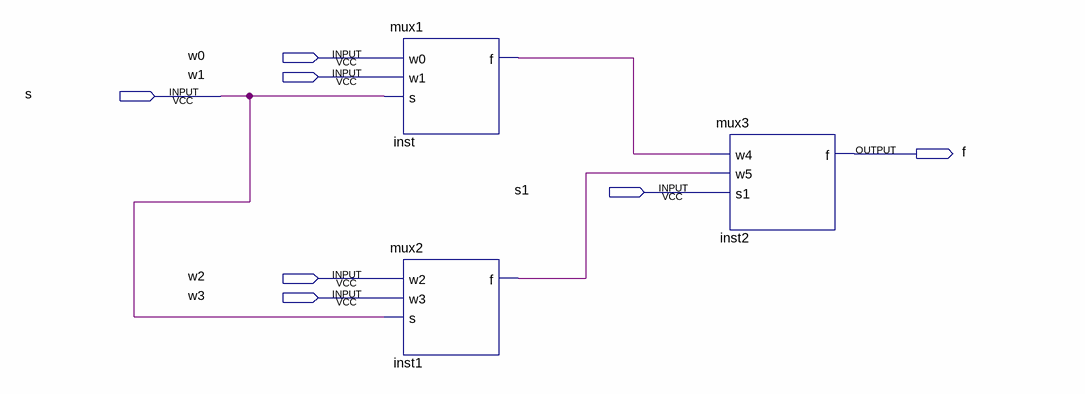
[diagram p0: schematic sheet]
// Quartus schematic muxModified.bdf as structural Verilog: 3 symbols, 7 pins
module muxModified (
  input  w0,
  input  w1,
  input  s,
  input  s1,
  input  w2,
  input  w3,
  output f
);

  wire inst1_f, inst_f;

  mux1 inst (.w0(w0), .w1(w1), .s(s), .f(inst_f));
  mux2 inst1 (.w2(w2), .w3(w3), .s(s), .f(inst1_f));
  mux3 inst2 (.w4(inst_f), .w5(inst1_f), .s1(s1), .f(f));
endmodule
